# Altium schematic sheet MOSFETs.SchDoc: MOSFETs
size A4; SheetNumber: 13; SheetTotal: 13
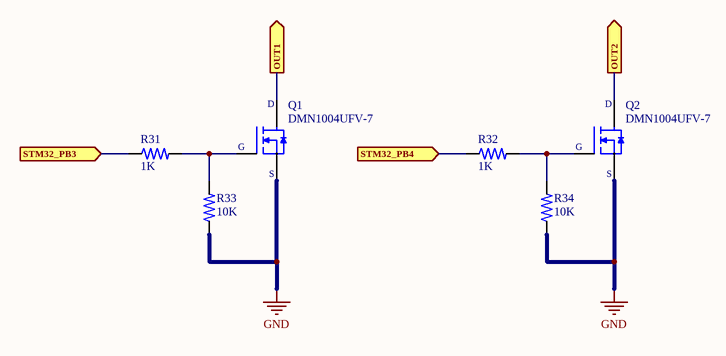
[diagram p0: MOSFETs.SchDoc]

## Parts
Q1  DMN1004UFV-7  [MergenElektronik_Transistors_Mosfets_8-PowerVDFN]
Q2  DMN1004UFV-7  [MergenElektronik_Transistors_Mosfets_8-PowerVDFN]
R31  1K  [MergenElektronik_Resistors_ChipResistors_0603_M_NS]
R32  1K  [MergenElektronik_Resistors_ChipResistors_0603_M_NS]
R33  10K  [MergenElektronik_Resistors_ChipResistors_0603_M_NS]
R34  10K  [MergenElektronik_Resistors_ChipResistors_0603_M_NS]

## Ports
OUT1 (out), OUT2 (out), STM32_PB3 (in, see Microcontroller[3C]), STM32_PB4 (in, see Microcontroller[3C])

## Nets
GND: Q1.2,_3,_4(Source) Q2.2,_3,_4(Source) R33.1 R34.1
OUT1: Q1.5(Drain) ; port OUT1
OUT2: Q2.5(Drain) ; port OUT2
STM32_PB3: R31.1 ; port STM32_PB3
STM32_PB4: R32.1 ; port STM32_PB4
NetQ1_1: Q1.1(Gate) R31.2 R33.2
NetQ2_1: Q2.1(Gate) R32.2 R34.2

## Notes on the sheet
- Title:
- Size:
- Date:
- A4
- Number:
- Time:
- Revision:
- Sheet
- of
- Project
- Drawn By :
- (in symbol MergenElektronik_Transistors_Mosfets_DMN1004UFV-7) D; G; S

## Library data of the parts
Q1 Q2 = MergenElektronik_Transistors_Mosfets_DMN1004UFV-7: Mergen Elektronik - Transistors - Mosfets - DMN1004UFV-7; Manufacturer: onsemi; Voltage Rating: 12V; Model: Mosfet; Id: 70A; Value: DMN1004UFV-7; Temperature: -55°C up to +150°C (TJ); Digi-Key Number: DMN1004UFV-7DITR-ND; Manufacturer Number: DMN1004UFV-7; Package: 8-PowerVDFN; Mounting Type: Surface Mount; Vdss: 12V; Rating Current: 70A; Mouser Number: 621-DMN1004UFV-7; Farnell Number: 3518380; Supplier 1: Digi-Key; Supplier 2: Mouser; Supplier Part Number 1: DMN1004UFV-7; Supplier Part Number 2: 621-DMN1004UFV-7; Current Rating: 70A
R31 R32 = MergenElektronik_Resistors_ChipResistors_0603_1K: Mergen Elektronik - Resistors - Chip Resistors - 0603 - 1K; Manufacturer: Stackpole Electronics Inc; Manufacturer Number: RMCF0603JT1K00; Value: Chip Resistor - 0603 - 1K; Power: 1/10W; Tolerance: ±5%; Package: 0603(1608); Temperature: -55°C up to +155°C - X8R; Model: Chip Resistor; Digi-Key Number: RMCF0603JT1K00CT-ND; Mounting Type: Surface Mount; Mouser Number: 708-RMCF0603JT1K00; Supplier 1: Digikey; Supplier 2: Mouser; Supplier Part Number 1: RMCF0603JT1K00DKR-ND; Supplier Part Number 2: 708-RMCF0603JT1K00
R33 R34 = MergenElektronik_Resistors_ChipResistors_0603_10K: Mergen Elektronik - Resistors - Chip Resistors - 0603 - 10K; Manufacturer: Stackpole Electronics Inc; Manufacturer Number: RMCF0603JT10K0; Value: Chip Resistor - 0603 - 10K; Power: 1/10W; Tolerance: ±5%; Package: 0603(1608); Temperature: -55°C up to +155°C - X8R; Model: Chip Resistor; Digi-Key Number: RMCF0603JT10K0CT-ND; Mounting Type: Surface Mount; Supplier 1: Digi-Key; Supplier Part Number 1: RMCF0603JT10K0-ND